# Altium project ESIMA_EIS.PrjPcb (part 1 of 2)
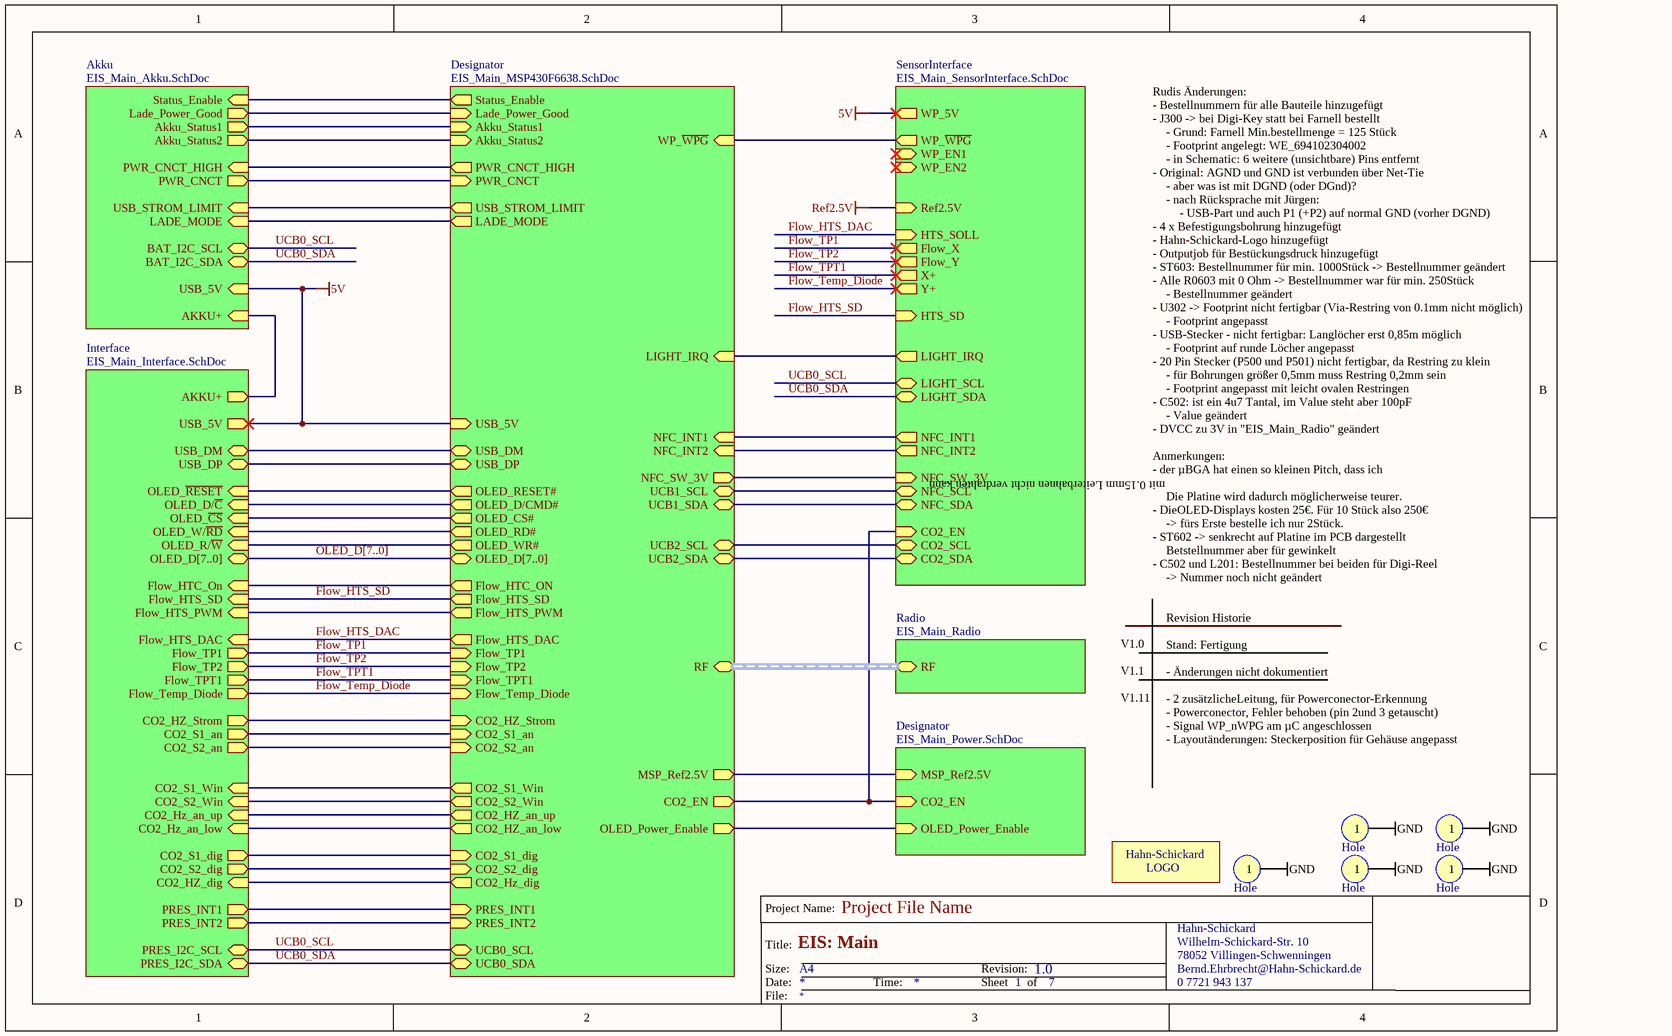
[diagram p0: EIS_Main.SchDoc]
7 sheets, 173 parts. Net scope: hierarchical (ports join the sheet entries above them; power ports are global).
Board file: ESIMA_EIS.PcbDoc
Sheets:
  EIS_Main.SchDoc
    Akku = EIS_Main_Akku.SchDoc
    Radio = EIS_Main_Radio.SchDoc
    Interface = EIS_Main_Interface.SchDoc
    Designator = EIS_Main_MSP430F6638.SchDoc
    SensorInterface = EIS_Main_SensorInterface.SchDoc
    Designator = EIS_Main_Power.SchDoc

## Sheet EIS_Main.SchDoc: EIS: Main
size A4; Organization: Hahn-Schickard; Address1: Wilhelm-Schickard-Str. 10; Address2: 78052 Villingen-Schwenningen; Address3: Bernd.Ehrbrecht@Hahn-Schickard.de; DocumentNumber: 1; Revision: 1.0; SheetNumber: 1; SheetTotal: 7; PhoneNumber: 0 7721 943 137; E-Mail: Xxxx.Xxxx@Hahn-Schickard.de; ProjectName: Project File Name

### Parts
LOGO1  Hahn-Schickard-Logo  [Hahn-Schickard-LOGO_klein]  (value not drawn)
X1  Hole  [Hole_2mm]
X2  Hole  [Hole_2mm]
X3  Hole  [Hole_2mm]
X4  Hole  [Hole_2mm]
X5  Hole  [Hole_2mm]

### Sub-sheets
Akku = EIS_Main_Akku.SchDoc: LADE_MODE (in), USB_STROM_LIMIT (in), Akku_Status1 (out), Akku_Status2 (out), BAT_I2C_SDA (bidir), BAT_I2C_SCL (bidir), USB_5V (in), Lade_Power_Good (out), Status_Enable (in), AKKU+ (in), PWR_CNCT (out), PWR_CNCT_HIGH (in)
Designator = EIS_Main_MSP430F6638.SchDoc: Flow_HTC_ON (out), OLED_D/CMD# (out), Flow_HTS_DAC (out), PRES_INT1 (in), LADE_MODE (out), USB_STROM_LIMIT (out), Akku_Status1 (in), Akku_Status2 (in), OLED_Power_Enable (out), Flow_TPT1 (in), Flow_TP1 (in), Flow_TP2 (in), Flow_Temp_Diode (in), UCB0_SCL (bidir), UCB0_SDA (bidir), CO2_S2_dig (in), CO2_S1_dig (in), CO2_HZ_Strom (in), CO2_Hz_dig (out), CO2_S1_an (in), CO2_S2_an (in), MSP_Ref2.5V (out), OLED_RESET# (out), OLED_CS# (out), USB_5V (in), CO2_HZ_an_low (out), CO2_S2_Win (out), CO2_S1_Win (out), CO2_HZ_an_up (out), PRES_INT2 (in), OLED_WR# (out), OLED_RD# (out), USB_DM (bidir), USB_DP (bidir), OLED_D[7..0] (bidir), RF (harness RF), Flow_HTS_SD (out), Flow_HTS_PWM (out), UCB1_SCL (bidir), UCB1_SDA (bidir), UCB2_SDA (bidir), UCB2_SCL (bidir), Lade_Power_Good (in), Status_Enable (out), CO2_EN (out), NFC_SW_3V (out), NFC_INT1 (in), NFC_INT2 (in), LIGHT_IRQ (in), WP_~{WPG} (in), PWR_CNCT (in), PWR_CNCT_HIGH (out)
Designator = EIS_Main_Power.SchDoc: CO2_EN (in), OLED_Power_Enable (in), MSP_Ref2.5V (in)
Interface = EIS_Main_Interface.SchDoc: USB_5V (out), USB_DM (bidir), USB_DP (bidir), OLED_D[7..0] (bidir), OLED_~{CS} (in), OLED_~{RESET} (in), OLED_D/~{C} (in), OLED_R/~{W} (in), OLED_W/~{RD} (in), Flow_TP2 (out), Flow_Temp_Diode (out), CO2_S2_an (out), CO2_S2_Win (in), CO2_Hz_an_low (in), Flow_HTS_SD (in), CO2_HZ_dig (in), CO2_S2_dig (out), PRES_INT2 (out), PRES_I2C_SDA (bidir), AKKU+ (out), Flow_TP1 (out), Flow_TPT1 (out), CO2_S1_an (out), CO2_HZ_Strom (out), Flow_HTS_DAC (in), CO2_S1_Win (in), CO2_Hz_an_up (in), Flow_HTC_On (in), Flow_HTS_PWM (in), CO2_S1_dig (out), PRES_INT1 (out), PRES_I2C_SCL (bidir)
Radio = EIS_Main_Radio: RF (harness RF)
SensorInterface = EIS_Main_SensorInterface.SchDoc: WP_5V (out), WP_~{WPG} (out), WP_EN1 (in), WP_EN2 (in), NFC_SW_3V (in), NFC_SDA (bidir), NFC_SCL (bidir), NFC_INT1 (out), NFC_INT2 (out), HTS_SD (in), HTS_SOLL (in), Flow_X (out), Flow_Y (out), X+ (out), Y+ (out), Ref2.5V (in), LIGHT_IRQ (out), LIGHT_SDA (bidir), LIGHT_SCL (bidir), CO2_SCL (bidir), CO2_SDA (bidir), CO2_EN (in)

### Nets
5V: sheet Akku/USB_5V, sheet Interface/USB_5V, sheet Designator/USB_5V, sheet SensorInterface/WP_5V  [project net USB_5V]
AKKU+: sheet Akku/AKKU+, sheet Interface/AKKU+
GND: X1.1 X2.1 X3.1 X4.1 X5.1
CO2_EN: sheet Designator/CO2_EN, sheet SensorInterface/CO2_EN, sheet Designator/CO2_EN
CO2_SCL: sheet Designator/UCB2_SCL, sheet SensorInterface/CO2_SCL
CO2_SDA: sheet Designator/UCB2_SDA, sheet SensorInterface/CO2_SDA
Flow_HTS_DAC: sheet Interface/Flow_HTS_DAC, sheet Designator/Flow_HTS_DAC, sheet SensorInterface/HTS_SOLL
Flow_HTS_SD: sheet Interface/Flow_HTS_SD, sheet Designator/Flow_HTS_SD, sheet SensorInterface/HTS_SD
Flow_Temp_Diode: sheet Interface/Flow_Temp_Diode, sheet Designator/Flow_Temp_Diode, sheet SensorInterface/Y+
Flow_TP1: sheet Interface/Flow_TP1, sheet Designator/Flow_TP1, sheet SensorInterface/Flow_X
Flow_TP2: sheet Interface/Flow_TP2, sheet Designator/Flow_TP2, sheet SensorInterface/Flow_Y
Flow_TPT1: sheet Interface/Flow_TPT1, sheet Designator/Flow_TPT1, sheet SensorInterface/X+
LIGHT_IRQ: sheet Designator/LIGHT_IRQ, sheet SensorInterface/LIGHT_IRQ
UCB0_SCL: sheet Akku/BAT_I2C_SCL, sheet Interface/PRES_I2C_SCL, sheet Designator/UCB0_SCL, sheet SensorInterface/LIGHT_SCL  [project net LIGHT_SCL]
UCB0_SDA: sheet Akku/BAT_I2C_SDA, sheet Interface/PRES_I2C_SDA, sheet Designator/UCB0_SDA, sheet SensorInterface/LIGHT_SDA  [project net LIGHT_SDA]
UCB1_SCL: sheet Designator/UCB1_SCL, sheet SensorInterface/NFC_SCL
UCB1_SDA: sheet Designator/UCB1_SDA, sheet SensorInterface/NFC_SDA
USB_DM: sheet Interface/USB_DM, sheet Designator/USB_DM
USB_DP: sheet Interface/USB_DP, sheet Designator/USB_DP
NetC103_1: sheet Designator/MSP_Ref2.5V, sheet Designator/MSP_Ref2.5V
NetJ300_2: sheet Akku/PWR_CNCT, sheet Designator/PWR_CNCT
NetP500_5: sheet Interface/CO2_S1_an, sheet Designator/CO2_S1_an
NetP500_6: sheet Interface/CO2_S2_an, sheet Designator/CO2_S2_an
NetP500_7: sheet Interface/CO2_HZ_Strom, sheet Designator/CO2_HZ_Strom
NetP500_13: sheet Interface/CO2_S1_Win, sheet Designator/CO2_S1_Win
NetP500_14: sheet Interface/CO2_S2_Win, sheet Designator/CO2_S2_Win
NetP500_15: sheet Interface/CO2_Hz_an_up, sheet Designator/CO2_HZ_an_up
NetP500_16: sheet Interface/CO2_Hz_an_low, sheet Designator/CO2_HZ_an_low
NetP501_1: sheet Interface/Flow_HTC_On, sheet Designator/Flow_HTC_ON
NetP501_3: sheet Interface/Flow_HTS_PWM, sheet Designator/Flow_HTS_PWM
NetP501_4: sheet Interface/CO2_HZ_dig, sheet Designator/CO2_Hz_dig
NetP501_5: sheet Interface/CO2_S1_dig, sheet Designator/CO2_S1_dig
NetP501_6: sheet Interface/CO2_S2_dig, sheet Designator/CO2_S2_dig
NetP501_7: sheet Interface/PRES_INT1, sheet Designator/PRES_INT1
NetP501_8: sheet Interface/PRES_INT2, sheet Designator/PRES_INT2
NetR107_1: sheet Designator/WP_~{WPG}, sheet SensorInterface/WP_~{WPG}
NetR305_2: sheet Akku/LADE_MODE, sheet Designator/LADE_MODE
NetR306_2: sheet Akku/USB_STROM_LIMIT, sheet Designator/USB_STROM_LIMIT
NetR310_1: sheet Akku/Status_Enable, sheet Designator/Status_Enable
NetR310_2: sheet Akku/Lade_Power_Good, sheet Designator/Lade_Power_Good
NetR311_2: sheet Akku/Akku_Status2, sheet Designator/Akku_Status2
NetR312_2: sheet Akku/Akku_Status1, sheet Designator/Akku_Status1
NetR316_1: sheet Akku/PWR_CNCT_HIGH, sheet Designator/PWR_CNCT_HIGH
NetST600_2: sheet Designator/NFC_INT2, sheet SensorInterface/NFC_INT2
NetST600_3: sheet Designator/NFC_INT1, sheet SensorInterface/NFC_INT1
NetST600_6: sheet Designator/NFC_SW_3V, sheet SensorInterface/NFC_SW_3V
NetU100_5: sheet Interface/OLED_~{RESET}, sheet Designator/OLED_RESET#
NetU100_6: sheet Interface/OLED_D/~{C}, sheet Designator/OLED_D/CMD#
NetU100_7: sheet Interface/OLED_R/~{W}, sheet Designator/OLED_WR#
NetU100_8: sheet Interface/OLED_W/~{RD}, sheet Designator/OLED_RD#
NetU100_52: sheet Designator/OLED_Power_Enable, sheet Designator/OLED_Power_Enable
NetU100_53: sheet Interface/OLED_~{CS}, sheet Designator/OLED_CS#

### Buses and harness runs
bus OLED_D[7..0] = sheet Designator/OLED_D[7..0] = sheet Interface/OLED_D[7..0]
harness sheet Designator/RF = sheet Radio/RF

### Notes on the sheet
- Rudis Änderungen:
- - Bestellnummern für alle Bauteile hinzugefügt
- - J300 -> bei Digi-Key statt bei Farnell bestellt
- - Original: AGND und GND ist verbunden über Net-Tie
- - Grund: Farnell Min.bestellmenge = 125 Stück
- - Footprint angelegt: WE_694102304002
- - in Schematic: 6 weitere (unsichtbare) Pins entfernt
- - 4 x Befestigungsbohrung hinzugefügt
- - Hahn-Schickard-Logo hinzugefügt
- - aber was ist mit DGND (oder DGnd)?
- - nach Rücksprache mit Jürgen:
- - USB-Part und auch P1 (+P2) auf normal GND (vorher DGND)
- - Outputjob für Bestückungsdruck hinzugefügt
- - ST603: Bestellnummer für min. 1000Stück -> Bestellnummer geändert
- - Alle R0603 mit 0 Ohm -> Bestellnummer war für min. 250Stück
- - U302 -> Footprint nicht fertigbar (Via-Restring von 0.1mm nicht möglich)
- - Bestellnummer geändert
- - USB-Stecker - nicht fertigbar: Langlöcher erst 0,85m möglich
- - 20 Pin Stecker (P500 und P501) nicht fertigbar, da Restring zu klein
- - Footprint angepasst
- - Footprint auf runde Löcher angepasst
- - für Bohrungen größer 0,5mm muss Restring 0,2mm sein
- - C502: ist ein 4u7 Tantal, im Value steht aber 100pF
- - DVCC zu 3V in "EIS_Main_Radio" geändert
- - Footprint angepasst mit leicht ovalen Restringen
- - Value geändert
- - der µBGA hat einen so kleinen Pitch, dass ich
- Anmerkungen:
- - DieOLED-Displays kosten 25€. Für 10 Stück also 250€
- mit 0.15mm Leiterbahnen nicht verdrahten kann
- Die Platine wird dadurch möglicherweise teurer.
- - ST602 -> senkrecht auf Platine im PCB dargestellt
- - C502 und L201: Bestellnummer bei beiden für Digi-Reel
- -> fürs Erste bestelle ich nur 2Stück.
- Betstellnummer aber für gewinkelt
- -> Nummer noch nicht geändert
- V1.0
- Revision Historie
- Stand: Fertigung
- V1.1
- V1.11
- - Änderungen nicht dokumentiert
- - 2 zusätzlicheLeitung, für Powerconector-Erkennung
- - Powerconector, Fehler behoben (pin 2und 3 getauscht)
- - Signal WP_nWPG am µC angeschlossen
- - Layoutänderungen: Steckerposition für Gehäuse angepasst
- Project Name:
- Size:
- Date:
- Title:
- A4
- Time:
- Revision:
- Sheet
- of
- File:
- (in symbol Hahn-Schickard-Logo) Hahn-Schickard; LOGO

### Library data of the parts
LOGO1 = Hahn-Schickard-Logo: Hahn-Schickard Logo als Footprint
X1-X5 = Hole: Durchkontaktierung d=4mm

## Sheet EIS_Main_Akku.SchDoc: EIS: Akkulader und Überwachung
size A4; FaxNumber: +49 7721 943 210; Organization: Hahn-Schickard; Address1: Wilhelm-Schickard-Str. 10; Address2: 78052 Villingen-Schwenningen; Address3: Bernd.Ehrbrecht@Hahn-Schickard.de; DocumentNumber: 1; Revision: 1.0; SheetNumber: 4; SheetTotal: 7; PhoneNumber: 0 7721 943 137; E-Mail: Xxxx.Xxxx@Hahn-Schickard.de; PageSetup: Record=PageOptions|CenterHorizontal=True|CenterVertical=True|PrintScale=0.97|XCorrection=1.00|YCorrection=1.00|PrintKind=0|BorderSize=5000000|LeftOffset=0|BottomOffset=0|Orientation=2|PaperLength=1000|PaperWidth=1000|Scale=100|PaperSource=7|PrintQuality=-3|MediaType=1|DitherType=10|PrintScaleMode=1|PaperKind=A4|PaperIndex=9; ProjectName: Project File Name
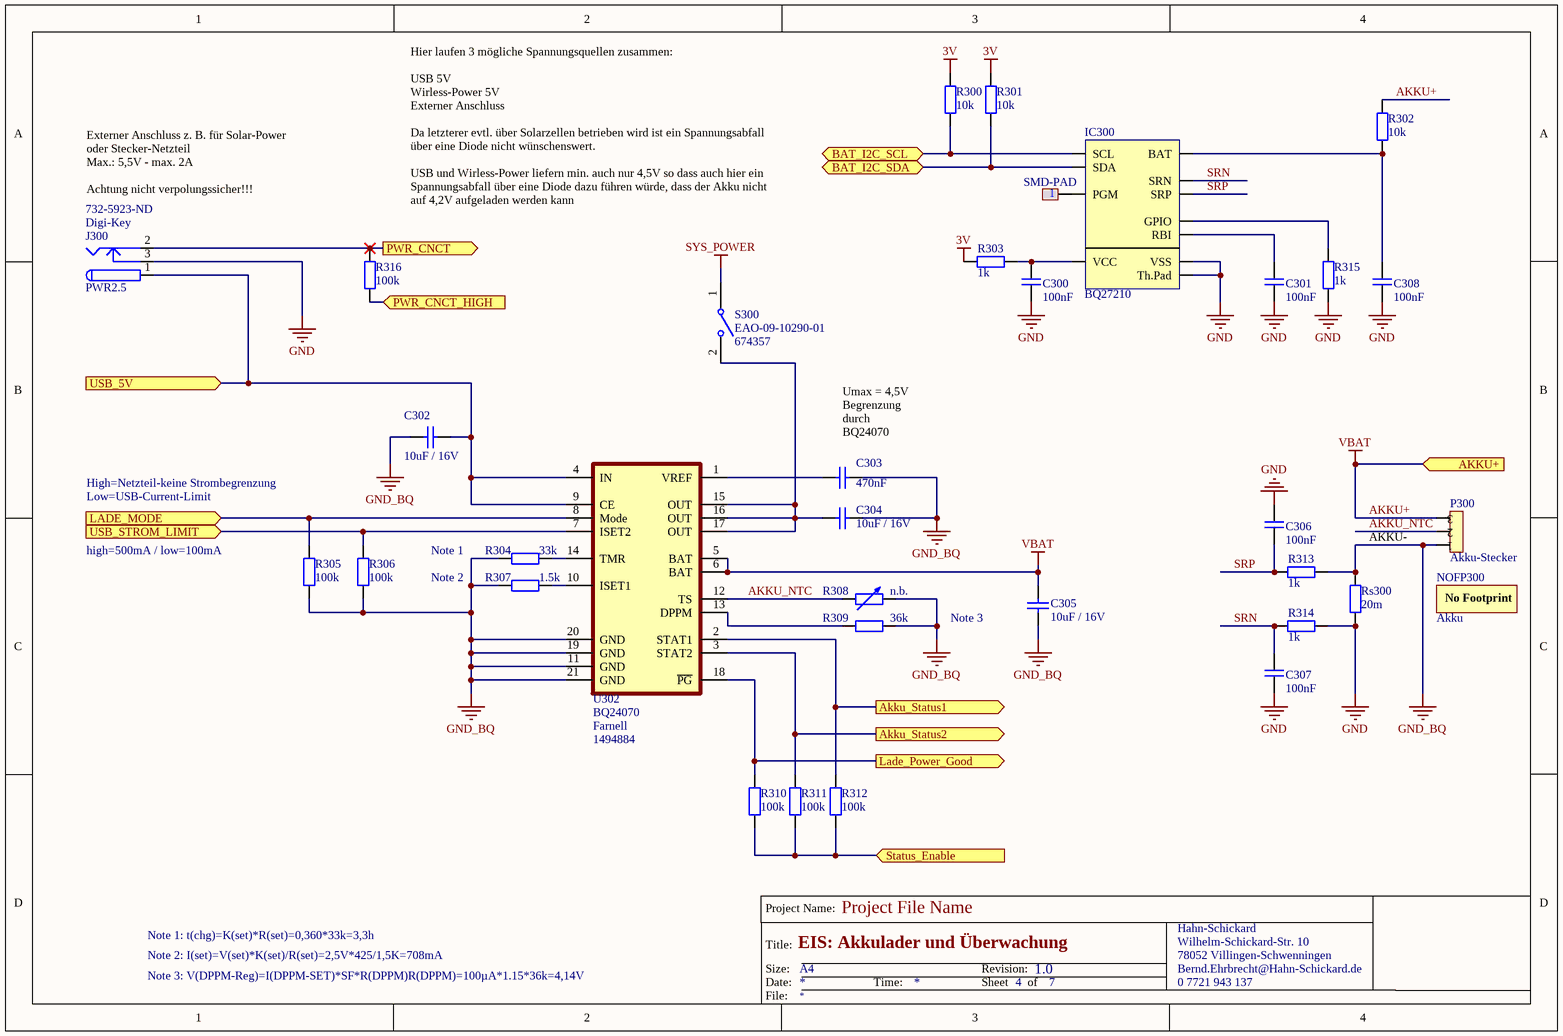
[diagram p1: EIS_Main_Akku.SchDoc]

### Parts
C300  100nF  [CAPC1608N]
C301  100nF  [CAPC1608N]
C302  10uF / 16V  [CAPC2012N]
C303  470nF  [CAPC1608N]
C304  10uF / 16V  [CAPC2012N]
C305  10uF / 16V  [CAPC2012N]
C306  100nF  [CAPC1608N]
C307  100nF  [CAPC1608N]
C308  100nF  [CAPC1608N]
IC300  BQ27210  [TI-DRK-PVSON]
J300  PWR2.5  Supplier 1: Digi-Key  Supplier Part Number 1: 732-5923-ND  [WE_694102304002]
NOFP300  value Akku  [No_Footprint]  (hidden comment: No-Footprint)
P300  Akku-Stecker  [S3B-XH-A]
R300  10k  [RESC1608N]
R301  10k  [RESC1608N]
R302  10k  [RESC1608N]
R303  1k  [RESC1608N]
R304  33k  [RESC1608N]
R305  100k  [RESC1608N]
R306  100k  [RESC1608N]
R307  1.5k  [RESC1608N]
R308  n.b.  [RESC1608N]
R309  36k  [RESC1608N]
R310  100k  [RESC1608N]
R311  100k  [RESC1608N]
R312  100k  [RESC1608N]
R313  1k  [RESC1608N]
R314  1k  [RESC1608N]
R315  1k  [RESC1608N]
R316  100k  [RESC1608N]
Rs300  20m  [RESC3216N]
S300  EAO-09-10290-01  Supplier Part Number 1: 674357  [EAO09-10290-01]
S301  SMD-PAD  [SMD_PAD]
U302  BQ24070  Supplier 1: Farnell  Supplier Part Number 1: 1494884  [R-PVQFN50P450X350X100-20N]

### Ports
AKKU+ (in), Akku_Status1 (out), Akku_Status2 (out), BAT_I2C_SCL (bidir), BAT_I2C_SDA (bidir), LADE_MODE (in), Lade_Power_Good (out), PWR_CNCT (out), PWR_CNCT_HIGH (in), Status_Enable (in), USB_5V (in), USB_STROM_LIMIT (in)

### Nets
3V: R300.2 R301.2 R303.2
AKKU+: C305.2 P300.3 R302.2 U302.5(BAT) U302.6(BAT) ; port AKKU+  [also labelled VBAT]
GND: C300.1 C301.1 C306.1 C307.1 C308.1 IC300.3(VSS) IC300.11(Th.Pad) J300.3 R314.1 R315.2 Rs300.1
GND_BQ: C302.1 C303.2 C304.2 C305.1 P300.1 R304.1 R305.1 R306.1 R307.1 R308.2 R309.2 R313.1 Rs300.2 U302.11(GND) U302.19(GND) U302.20(GND) U302.21(GND)
SYS_POWER: S300.1(COMMON)
USB_5V: C302.2 J300.1 U302.4(IN) U302.9(CE) ; port USB_5V
AKKU_NTC: P300.2 R308.1 U302.12(TS)
LIGHT_SCL: IC300.4(SCL) R300.1 ; port BAT_I2C_SCL
LIGHT_SDA: IC300.5(SDA) R301.1 ; port BAT_I2C_SDA
SRN: C307.2 IC300.7(SRN) R314.2
SRP: C306.2 IC300.8(SRP) R313.2
NetC300_2: C300.2 IC300.2(VCC) R303.1
NetC301_2: C301.2 IC300.1(RBI)
NetC303_1: C303.1 U302.1(VREF)
NetC304_1: C304.1 S300.2(NO) U302.15(OUT) U302.16(OUT) U302.17(OUT)
NetC308_2: C308.2 IC300.6(BAT) R302.1
NetIC300_9: IC300.9(GPIO) R315.1
NetIC300_10: IC300.10(PGM) S301.1
NetJ300_2: J300.2 R316.2 ; port PWR_CNCT
NetR304_2: R304.2 U302.14(TMR)
NetR305_2: R305.2 U302.8(Mode) ; port LADE_MODE
NetR306_2: R306.2 U302.7(ISET2) ; port USB_STROM_LIMIT
NetR307_2: R307.2 U302.10(ISET1)
NetR309_1: R309.1 U302.13(DPPM)
NetR310_1: R310.1 R311.1 R312.1 ; port Status_Enable
NetR310_2: R310.2 U302.18(~{PG}) ; port Lade_Power_Good
NetR311_2: R311.2 U302.3(STAT2) ; port Akku_Status2
NetR312_2: R312.2 U302.2(STAT1) ; port Akku_Status1
NetR316_1: R316.1 ; port PWR_CNCT_HIGH

### Notes on the sheet
- Externer Anschluss z. B. für Solar-Power
  oder Stecker-Netzteil
  Max.: 5,5V - max. 2A
  Achtung nicht verpolungssicher!!!
- Hier laufen 3 mögliche Spannungsquellen zusammen:
  USB 5V
  Wirless-Power 5V
  Externer Anschluss
  Da letzterer evtl. über Solarzellen betrieben wird ist ein Spannungsabfall über eine Diode nicht wünschenswert.
  USB und Wirless-Power liefern min. auch nur 4,5V so dass auch hier ein Spannungsabfall über eine Diode dazu führen würde, dass der Akku nicht auf 4,2V aufgeladen werden kann
- (near C303) Umax = 4,5V
  Begrenzung
  durch
  BQ24070
- Low=USB-Current-Limit
- High=Netzteil-keine Strombegrenzung
- high=500mA / low=100mA
- Note 2
- Note 1
- AKKU-
- Note 3
- Note 1: t(chg)=K(set)*R(set)=0,360*33k=3,3h
- Note 2: I(set)=V(set)*K(set)/R(set)=2,5V*425/1,5K=708mA
- Note 3: V(DPPM-Reg)=I(DPPM-SET)*SF*R(DPPM)R(DPPM)=100µA*1.15*36k=4,14V
- Project Name:
- Size:
- Date:
- Title:
- A4
- Time:
- Revision:
- Sheet
- of
- File:
- (in symbol No-Footprint) No Footprint

### Library data of the parts
C300 C301 C306-C308 = Kondensator SMD Keramik: 07_Lieferant: Digi-Key; 08_Lieferanten_Nummer: 399-1096-1-ND
C302 C304 C305 = C0805: Ceramic Chip Capacitor - Standard; Note: Footprint corresponds to dimensions for bulk cassette packaging. This case size has tightened tolerances.; 07_Lieferant: Digi-Key; 08_Lieferanten_Nummer: 490-6473-1-ND; Published: 17-Jul-2002; LatestRevisionDate: 19-Mar-2004; LatestRevisionNote: Silkscreen size reduced.; DatasheetDocument: Mar-2001; PackageDocument: Mar-2001; PackageReference: 0805; Publisher: Altium Limited; Code_JEITA: 0805; Code_IPC: 2012[0805]; ComponentLink1Description: Manufacturer Link; ComponentLink1URL: http://www.kemet.com/; ComponentLink2Description: Datasheet; ComponentLink2URL: http://www.kemet.com/kemet/web/homepage/kechome.nsf/vapubfilesname/F3102TA.pdf/$file/F3102TA.pdf; Value: 10uF / 16V
C303 = C0805: Ceramic Chip Capacitor - Standard; Note: Footprint corresponds to dimensions for bulk cassette packaging. This case size has tightened tolerances.; 07_Lieferant: Digi-Key; 08_Lieferanten_Nummer: 445-5152-1-ND; Published: 17-Jul-2002; LatestRevisionDate: 19-Mar-2004; LatestRevisionNote: Silkscreen size reduced.; DatasheetDocument: Mar-2001; PackageDocument: Mar-2001; PackageReference: 0805; Publisher: Altium Limited; Code_JEITA: 0805; Code_IPC: 2012[0805]; ComponentLink1Description: Manufacturer Link; ComponentLink1URL: http://www.kemet.com/; ComponentLink2Description: Datasheet; ComponentLink2URL: http://www.kemet.com/kemet/web/homepage/kechome.nsf/vapubfilesname/F3102TA.pdf/$file/F3102TA.pdf; Value: 470nF
IC300 = BQ27210: i-Ion AND Li-Pol BATTERY GAS GAUGE IC FOR PORTABLE APPLICATIONS; 08_Lieferanten_Nummer: 296-21511-1-ND; 07_Lieferant: Digi-Key; 05_Datasheet_Link_Lokal: Path and File; 10_Erstell_Datum: DD.MM.YYYY; 09_Ersteller: HSG Name; 02_Herstellerbezeichnung: ka; 03_Hersteller_Link: Link; 04_Datasheet_Link: Datasheet; 06 Footprint_Link_Lokal: Path and File
J300 = PWR2.5: Low Voltage Power Supply Connector; Published: 17-Dec-2003; DatasheetDocument: 09-May-2002; Publisher: Altium Limited; ComponentLink1Description: Manufacturer Link; ComponentLink1URL: http://domino.kycon.com/internet/Products.html; 07_Lieferant: Digi-Key; 08_Lieferanten_Nummer: 732-5923-ND
NOFP300 = No-Footprint: Dummy-Bauteil, um Zusatzbestellungen in die BOM einzutragen; 07_Lieferant: Farnell; 08_Lieferanten_Nummer: 2401853
P300 = Header 3X1: Header, 3-Pin; 08_Lieferanten_Nummer: 1516290; 07_Lieferant: Farnell; LatestRevisionDate: 17-Jul-2002; LatestRevisionNote: Re-released for DXP Platform.; Publisher: Altium Limited
R300-R302 = Res2: Resistor; 07_Lieferant: Digi-Key; 08_Lieferanten_Nummer: 311-10KGRCT-ND; Published: 8-Jun-2000; LatestRevisionDate: 17-Jul-2002; LatestRevisionNote: Re-released for DXP Platform.; PackageReference: AXIAL-0.4; Publisher: Altium Limited; Value: 10k
R303 R313-R315 = Res2: Resistor; 07_Lieferant: Farnell; 08_Lieferanten_Nummer: 2309108; Published: 8-Jun-2000; LatestRevisionDate: 17-Jul-2002; LatestRevisionNote: Re-released for DXP Platform.; PackageReference: AXIAL-0.4; Publisher: Altium Limited; Value: 1k
R304 = Res2: Resistor; 07_Lieferant: Digi-Key; 08_Lieferanten_Nummer: 311-33KGRCT-ND; Published: 8-Jun-2000; LatestRevisionDate: 17-Jul-2002; LatestRevisionNote: Re-released for DXP Platform.; PackageReference: AXIAL-0.4; Publisher: Altium Limited; Value: 33k
R305 R306 R310-R312 R316 = Res2: Resistor; 07_Lieferant: Digi-Key; 08_Lieferanten_Nummer: 311-100KGRCT-ND; Published: 8-Jun-2000; LatestRevisionDate: 17-Jul-2002; LatestRevisionNote: Re-released for DXP Platform.; PackageReference: AXIAL-0.4; Publisher: Altium Limited; Value: 100k
R307 = Res2: Resistor; 07_Lieferant: Digi-Key; 08_Lieferanten_Nummer: RG16P1.5KBTR-ND; Published: 8-Jun-2000; LatestRevisionDate: 17-Jul-2002; LatestRevisionNote: Re-released for DXP Platform.; PackageReference: AXIAL-0.4; Publisher: Altium Limited; Value: 1.5k
R308 = Res Adj2: Variable Resistor; Set Position: 0.5; Published: 8-Jun-2000; LatestRevisionDate: 17-Jul-2002; LatestRevisionNote: Re-released for DXP Platform.; PackageReference: AXIAL-0.6; Publisher: Altium Limited; Value: n.b.; Supplier 1: Farnell; Supplier Part Number 1: 1672343
R309 = Res2: Resistor; 07_Lieferant: Digi-Key; 08_Lieferanten_Nummer: 311-36KGRCT-ND; Published: 8-Jun-2000; LatestRevisionDate: 17-Jul-2002; LatestRevisionNote: Re-released for DXP Platform.; PackageReference: AXIAL-0.4; Publisher: Altium Limited; Value: 36k
Rs300 = RESC1005N (R0402): Suplier: Seller; Suplier Ordering Number: Ordering Number; 07_Lieferant: Farnell; 08_Lieferanten_Nummer: 1462292; Published: 14.08.2009; Publisher: HSG Jürgen Merz; Value: 20m; ComponentLink1Description: RESC1005N (R0402) 1%
S300 = Schalter universal 1Polig: 01_Hersteller: Manufaktor Link; 05_Datasheet_Link_Lokal: Path and File; 10_Erstell_Datum: DD-MM-YYYY; 09_Ersteller: HSG Name; 02_Herstellerbezeichnung: ka; 07_Lieferant: Farnell; 03_Hersteller_Link: Link; 04_Datasheet_Link: Datasheet; 06 Footprint_Link_Lokal: Path and File; Supplier 1: Farnell; 08_Lieferanten_Nummer: 674357
S301 = SMD_PAD: SMD-PAD für Debugvorgang
U302 = BQ24070: Lithum Ion Ladebaustein, Power Path; 07_Lieferant: Farnell; 08_Lieferanten_Nummer: 1494884

## Sheet EIS_Main_Radio.SchDoc: EIS: Funk-Anbindung
size A4; FaxNumber: +49 7721 943 210; Organization: Hahn-Schickard; Address1: Wilhelm-Schickard-Str. 10; Address2: 78052 Villingen-Schwenningen; Address3: Bernd.Ehrbrecht@Hahn-Schickard.de; DocumentNumber: 1; Revision: 1.0; SheetNumber: 5; SheetTotal: 7; PhoneNumber: 0 7721 943 137; E-Mail: Xxxx.Xxxx@Hahn-Schickard.de; ProjectName: Project File Name
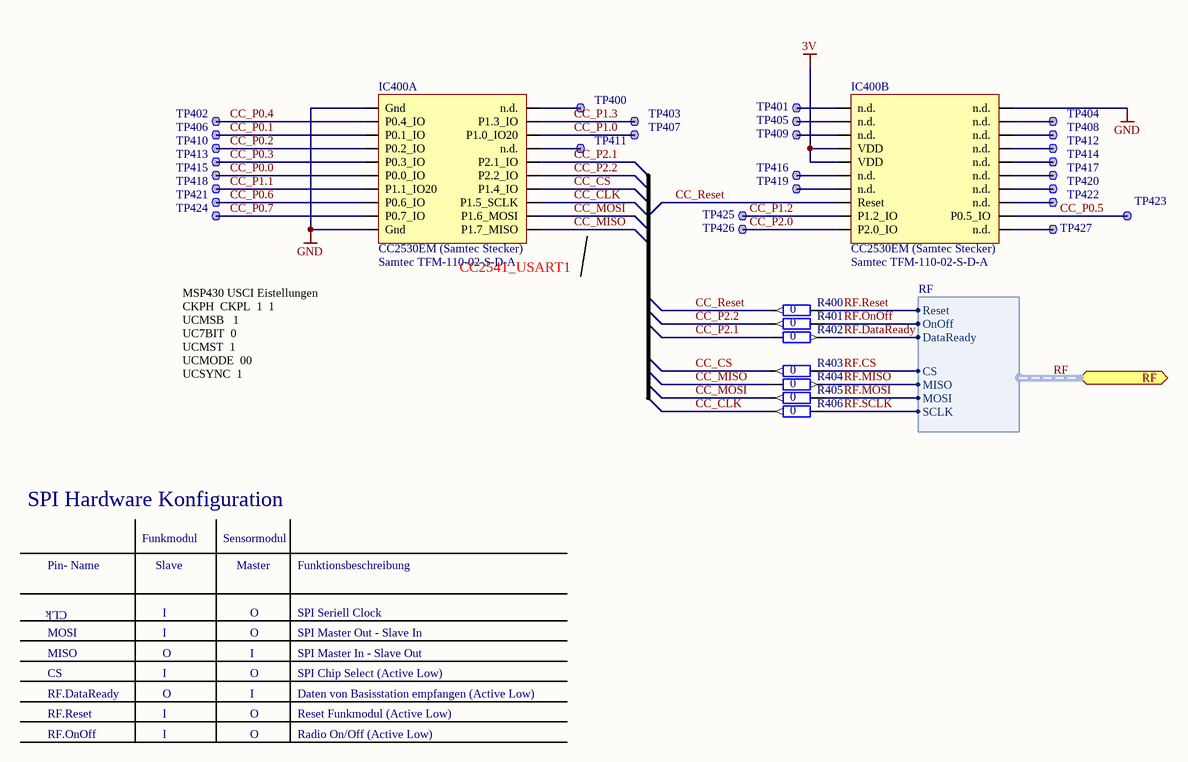
[diagram p2: EIS_Main_Radio.SchDoc]

### Parts
IC400  CC2530EM (Samtec Stecker)  01_Hersteller: Samtec TFM-110-02-S-D-A  [CC2400EM_Board]  (parts A,B of 2)
R400  0  [RESC1608N]
R401  0  [RESC1608N]
R402  0  [RESC1608N]
R403  0  [RESC1608N]
R404  0  [RESC1608N]
R405  0  [RESC1608N]
R406  0  [RESC1608N]
TP400  Testpoint 1mm  [Testpoint 1mm]  (value not drawn)  (no BOM)
TP401  Testpoint 1mm  [Testpoint 1mm]  (value not drawn)  (no BOM)
TP402  Testpoint 1mm  [Testpoint 1mm]  (value not drawn)  (no BOM)
TP403  Testpoint 1mm  [Testpoint 1mm]  (value not drawn)  (no BOM)
TP404  Testpoint 1mm  [Testpoint 1mm]  (value not drawn)  (no BOM)
TP405  Testpoint 1mm  [Testpoint 1mm]  (value not drawn)  (no BOM)
TP406  Testpoint 1mm  [Testpoint 1mm]  (value not drawn)  (no BOM)
TP407  Testpoint 1mm  [Testpoint 1mm]  (value not drawn)  (no BOM)
TP408  Testpoint 1mm  [Testpoint 1mm]  (value not drawn)  (no BOM)
TP409  Testpoint 1mm  [Testpoint 1mm]  (value not drawn)  (no BOM)
TP410  Testpoint 1mm  [Testpoint 1mm]  (value not drawn)  (no BOM)
TP411  Testpoint 1mm  [Testpoint 1mm]  (value not drawn)  (no BOM)
TP412  Testpoint 1mm  [Testpoint 1mm]  (value not drawn)  (no BOM)
TP413  Testpoint 1mm  [Testpoint 1mm]  (value not drawn)  (no BOM)
TP414  Testpoint 1mm  [Testpoint 1mm]  (value not drawn)  (no BOM)
TP415  Testpoint 1mm  [Testpoint 1mm]  (value not drawn)  (no BOM)
TP416  Testpoint 1mm  [Testpoint 1mm]  (value not drawn)  (no BOM)
TP417  Testpoint 1mm  [Testpoint 1mm]  (value not drawn)  (no BOM)
TP418  Testpoint 1mm  [Testpoint 1mm]  (value not drawn)  (no BOM)
TP419  Testpoint 1mm  [Testpoint 1mm]  (value not drawn)  (no BOM)
TP420  Testpoint 1mm  [Testpoint 1mm]  (value not drawn)  (no BOM)
TP421  Testpoint 1mm  [Testpoint 1mm]  (value not drawn)  (no BOM)
TP422  Testpoint 1mm  [Testpoint 1mm]  (value not drawn)  (no BOM)
TP423  Testpoint 1mm  [Testpoint 1mm]  (value not drawn)  (no BOM)
TP424  Testpoint 1mm  [Testpoint 1mm]  (value not drawn)  (no BOM)
TP425  Testpoint 1mm  [Testpoint 1mm]  (value not drawn)  (no BOM)
TP426  Testpoint 1mm  [Testpoint 1mm]  (value not drawn)  (no BOM)
TP427  Testpoint 1mm  [Testpoint 1mm]  (value not drawn)  (no BOM)

### Ports
RF (harness RF)

### Harnesses
RF: SCLK, MOSI, MISO, CS, DataReady, OnOff, Reset

### Nets
3V: IC400.P2_7(VDD) IC400.P2_9(VDD)
GND: IC400.P1_1(Gnd) IC400.P1_19(Gnd) IC400.P2_2(n.d.)
CC_CLK: IC400.P1_16(P1.5_SCLK) R406.1
CC_CS: IC400.P1_14(P1.4_IO) R403.1
CC_MISO: IC400.P1_20(P1.7_MISO) R404.1
CC_MOSI: IC400.P1_18(P1.6_MOSI) R405.1
CC_P0.0: IC400.P1_11(P0.0_IO) TP415.1
CC_P0.1: IC400.P1_5(P0.1_IO) TP406.1
CC_P0.2: IC400.P1_7(P0.2_IO) TP410.1
CC_P0.3: IC400.P1_9(P0.3_IO) TP413.1
CC_P0.4: IC400.P1_3(P0.4_IO) TP402.1
CC_P0.5: IC400.P2_18(P0.5_IO) TP423.1
CC_P0.6: IC400.P1_15(P0.6_IO) TP421.1
CC_P0.7: IC400.P1_17(P0.7_IO) TP424.1
CC_P1.0: IC400.P1_6(P1.0_IO20) TP407.1
CC_P1.1: IC400.P1_13(P1.1_IO20) TP418.1
CC_P1.2: IC400.P2_17(P1.2_IO) TP425.1
CC_P1.3: IC400.P1_4(P1.3_IO) TP403.1
CC_P2.0: IC400.P2_19(P2.0_IO) TP426.1
CC_P2.1: IC400.P1_10(P2.1_IO) R402.1
CC_P2.2: IC400.P1_12(P2.2_IO) R401.1
CC_Reset: IC400.P2_15(Reset) R400.1
RF.CS: R403.2 ; port RF.CS
RF.DataReady: R402.2 ; port RF.DataReady
RF.MISO: R404.2 ; port RF.MISO
RF.MOSI: R405.2 ; port RF.MOSI
RF.OnOff: R401.2 ; port RF.OnOff
RF.Reset: R400.2 ; port RF.Reset
RF.SCLK: R406.2 ; port RF.SCLK
NetIC400_P1_2: IC400.P1_2(n.d.) TP400.1
NetIC400_P1_8: IC400.P1_8(n.d.) TP411.1
NetIC400_P2_1: IC400.P2_1(n.d.) TP401.1
NetIC400_P2_3: IC400.P2_3(n.d.) TP405.1
NetIC400_P2_4: IC400.P2_4(n.d.) TP404.1
NetIC400_P2_5: IC400.P2_5(n.d.) TP409.1
NetIC400_P2_6: IC400.P2_6(n.d.) TP408.1
NetIC400_P2_8: IC400.P2_8(n.d.) TP412.1
NetIC400_P2_10: IC400.P2_10(n.d.) TP414.1
NetIC400_P2_11: IC400.P2_11(n.d.) TP416.1
NetIC400_P2_12: IC400.P2_12(n.d.) TP417.1
NetIC400_P2_13: IC400.P2_13(n.d.) TP419.1
NetIC400_P2_14: IC400.P2_14(n.d.) TP420.1
NetIC400_P2_16: IC400.P2_16(n.d.) TP422.1
NetIC400_P2_20: IC400.P2_20(n.d.) TP427.1

### Buses and harness runs
harness RF = port RF

### Notes on the sheet
- (near IC400) CC2541_USART1
- MSP430 USCI Eistellungen
  CKPH  CKPL 	1  1
  UCMSB 		1
  UC7BIT		0
  UCMST		1
  UCMODE		00
  UCSYNC		1
- SPI Hardware Konfiguration
- Pin- Name
- Funkmodul
- Slave
- Sensormodul
- Master
- Funktionsbeschreibung
- MOSI
- CLk
- I
- O
- SPI Seriell Clock
- SPI Master Out - Slave In
- MISO
- CS
- RF.DataReady
- RF.Reset
- SPI Chip Select (Active Low)
- Reset Funkmodul (Active Low)
- Daten von Basisstation empfangen (Active Low)
- SPI Master In - Slave Out
- RF.OnOff
- Radio On/Off (Active Low)
- Project Name:
- Size:
- Date:
- Title:
- A4
- Time:
- Revision:
- Sheet
- of
- File:

### Library data of the parts
IC400 = CC2530EM: CC2530EM Referenzdesign, Samtec TFM-110-02-S-D-A; 05_Datasheet_Link_Lokal: O:\Altium Designer\Datasheets\Texas Instruments\CC2400EVA; 09_Ersteller: HSG Rachid Nouna; 02_Herstellerbezeichnung: ka; 03_Hersteller_Link: http://www.ti.com; 04_Datasheet_Link: Datasheet; 06 Footprint_Link_Lokal: O:\Altium Designer\Datasheets\Texas Instruments\CC2400EVA; 10_Erstell_Datum: 21.9.2009; 07_Lieferant: Samtec; 08_Lieferanten_Nummer: TFM-110-02-S-D-A
R400-R406 = RESC1608 (R0603): 07_Lieferant: Farnell; 08_Lieferanten_Nummer: 2059527; Supplier 1: Farnell; Supplier Part Number 1: 2008343
TP400-TP427 = Tespoint 1mm

## Sheet EIS_Main_Interface.SchDoc: Optionale Schnittstellen
size A4; Organization: Hahn-Schickard; Address1: Wilhelm-Schickard-Str. 10; Address2: 78052 Villingen-Schwenningen; Address3: Bernd.Ehrbrecht@Hahn-Schickard.de; DocumentNumber: 1; Revision: 1.0; SheetNumber: 6; SheetTotal: 7; PhoneNumber: 0 7721 943 137; E-Mail: Xxxx.Xxxx@Hahn-Schickard.de; ProjectName: Project File Name
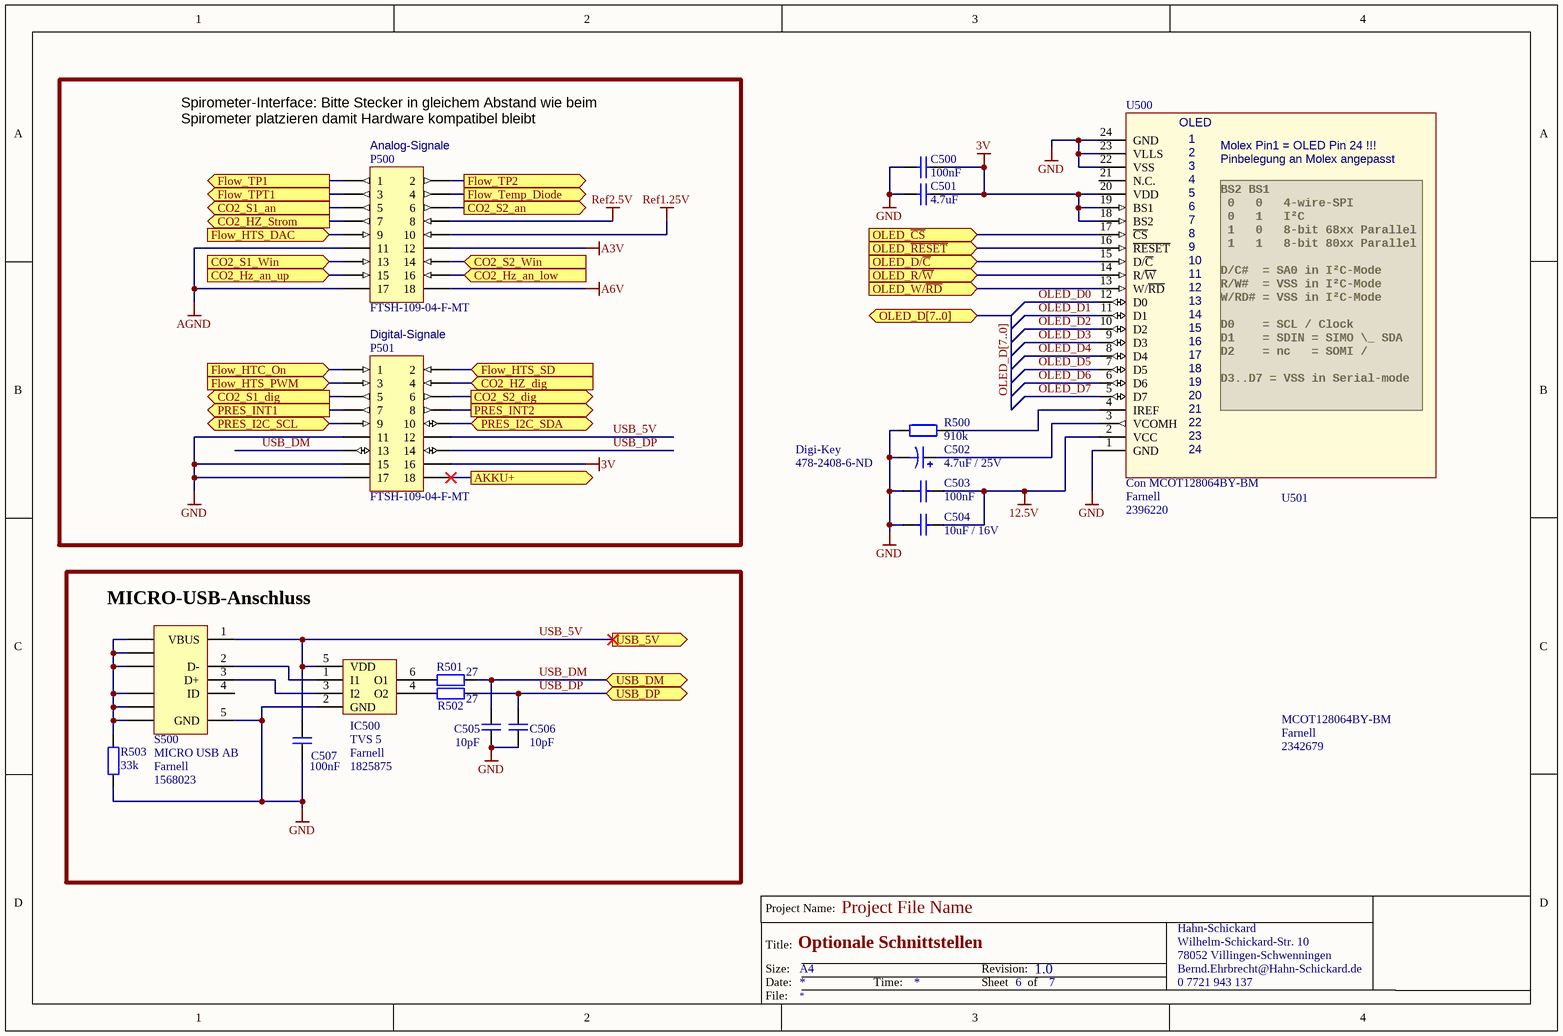
[diagram p3: EIS_Main_Interface.SchDoc]

### Parts
C500  100nF  [CAPC1608N]
C501  4.7uF  [CAPC2012N]
C502  4.7uF / 25V  Supplier 1: Digi-Key  Supplier Part Number 1: 478-2408-6-ND  [C1210]
C503  100nF  [CAPC1608N]
C504  10uF / 16V  [CAPC2012N]
C505  10pF  [CAPC1608N]
C506  10pF  [CAPC1608N]
C507  100nF  [CAPC1608N]
IC500  TVS 5  Supplier 1: Farnell  Supplier Part Number 1: 1825875  [SOT23-6]
P500  FTSH-109-04-F-MT  [FTSH-109-01-X-MT-spezial]
P501  FTSH-109-04-F-MT  [FTSH-109-01-X-MT-spezial]
R500  910k  [RESC1608N]
R501  27  [RESC1608N]
R502  27  [RESC1608N]
R503  33k  [RESC1608N]
S500  MICRO USB AB  Supplier 1: Farnell  Supplier Part Number 1: 1568023  [MICRO USB AB REC]
U500  Con MCOT128064BY-BM  Supplier 1: Farnell  Supplier Part Number 1: 2396220  [Molex-52435-2471]
U501  MCOT128064BY-BM  Supplier 1: Farnell  Supplier Part Number 1: 2342679  (mechanical)

### Ports
AKKU+ (out), CO2_Hz_an_low (in), CO2_Hz_an_up (in), CO2_HZ_dig (in), CO2_HZ_Strom (out), CO2_S1_an (out), CO2_S1_dig (out), CO2_S1_Win (in), CO2_S2_an (out), CO2_S2_dig (out), CO2_S2_Win (in), Flow_HTC_On (in), Flow_HTS_DAC (in), Flow_HTS_PWM (in), Flow_HTS_SD (in), Flow_Temp_Diode (out), Flow_TP1 (out), Flow_TP2 (out), Flow_TPT1 (out), OLED_D/~{C} (in), OLED_D[7..0] (bidir), OLED_R/~{W} (in), OLED_W/~{RD} (in), OLED_~{CS} (in), OLED_~{RESET} (in), PRES_I2C_SCL (bidir), PRES_I2C_SDA (bidir), PRES_INT1 (out), PRES_INT2 (out), USB_5V (out), USB_DM (bidir), USB_DP (bidir)

### Nets
3V: C500.2 C501.2 P501.16 U500.18(BS2) U500.19(BS1) U500.20(VDD)
12.5V: C503.1 C504.1 U500.2(VCC)
A3V: P500.12
A6V: P500.18
AGND: P500.11 P500.17
AKKU+: P501.18 ; port AKKU+
GND: C500.1 C501.1 C502.2 C503.2 C504.2 C505.2 C506.2 C507.2 IC500.2(GND) P501.11 P501.15 P501.17 R500.2 R503.1 S500.5(GND) U500.1(GND) U500.22(VSS) U500.23(VLLS) U500.24(GND)
Ref1.25V: P500.10
Ref2.5V: P500.8
USB_5V: C507.1 IC500.5(VDD) P501.12 S500.1(VBUS) ; port USB_5V
Flow_HTS_DAC: P500.9 ; port Flow_HTS_DAC
Flow_HTS_SD: P501.2 ; port Flow_HTS_SD
Flow_Temp_Diode: P500.4 ; port Flow_Temp_Diode
Flow_TP1: P500.1 ; port Flow_TP1
Flow_TP2: P500.2 ; port Flow_TP2
Flow_TPT1: P500.3 ; port Flow_TPT1
LIGHT_SCL: P501.9 ; port PRES_I2C_SCL
LIGHT_SDA: P501.10 ; port PRES_I2C_SDA
OLED_D0: U500.12(D0)
OLED_D1: U500.11(D1)
OLED_D2: U500.10(D2)
OLED_D3: U500.9(D3)
OLED_D4: U500.8(D4)
OLED_D5: U500.7(D5)
OLED_D6: U500.6(D6)
OLED_D7: U500.5(D7)
USB_DM: C505.1 P501.13 R501.2 ; port USB_DM
USB_DP: C506.1 P501.14 R502.2 ; port USB_DP
NetC502_1: C502.1 U500.3(VCOMH)
NetIC500_1: IC500.1(I1) S500.2(D-)
NetIC500_3: IC500.3(I2) S500.3(D+)
NetIC500_4: IC500.4(O2) R502.1
NetIC500_6: IC500.6(O1) R501.1
NetP500_5: P500.5 ; port CO2_S1_an
NetP500_6: P500.6 ; port CO2_S2_an
NetP500_7: P500.7 ; port CO2_HZ_Strom
NetP500_13: P500.13 ; port CO2_S1_Win
NetP500_14: P500.14 ; port CO2_S2_Win
NetP500_15: P500.15 ; port CO2_Hz_an_up
NetP500_16: P500.16 ; port CO2_Hz_an_low
NetP501_1: P501.1 ; port Flow_HTC_On
NetP501_3: P501.3 ; port Flow_HTS_PWM
NetP501_4: P501.4 ; port CO2_HZ_dig
NetP501_5: P501.5 ; port CO2_S1_dig
NetP501_6: P501.6 ; port CO2_S2_dig
NetP501_7: P501.7 ; port PRES_INT1
NetP501_8: P501.8 ; port PRES_INT2
NetR500_1: R500.1 U500.4(IREF)
NetR503_2: R503.2 S500.GND1(SHLD) S500.GND2(SHLD) S500.GND3(SHLD) S500.GND4(SHLD) S500.GND5(SHLD) S500.GND6(SHLD)
NetU100_5: U500.16(~{RESET}) ; port OLED_~{RESET}
NetU100_6: U500.15(D/~{C}) ; port OLED_D/~{C}
NetU100_7: U500.14(R/~{W}) ; port OLED_R/~{W}
NetU100_8: U500.13(W/~{RD}) ; port OLED_W/~{RD}
NetU100_53: U500.17(~{CS}) ; port OLED_~{CS}

Not connected (* = marked no-connect by the designer): S500 4(ID); U500 21(N.C.)

### Buses and harness runs
bus OLED_D[7..0] = port OLED_D[7..0]

### Notes on the sheet
- (near P500) Spirometer-Interface: Bitte Stecker in gleichem Abstand wie beim Spirometer platzieren damit Hardware kompatibel bleibt
- (near P500) Analog-Signale
- Digital-Signale
- (near S500) MICRO-USB-Anschluss
- Project Name:
- Size:
- Date:
- Title:
- A4
- Time:
- Revision:
- Sheet
- of
- File:
- (in symbol Con MCOT128064BY-BM) OLED; Molex Pin1 = OLED Pin 24 !!!; Pinbelegung an Molex angepasst; BS2 BS1 / 0   0   4-wire-SPI / 0   1   I²C / 1   0   8-bit 68xx Parallel / 1   1   8-bit 80xx Parallel / D/C#  = SA0 in I²C-Mode / R/W#  = VSS in I²C-Mode / W/RD# = VSS in I²C-Mode / D0    = SCL / Clock / D1    = SDIN = SIMO \_ SDA / D2    = nc   = SOMI / / D3..D7 = VSS in Serial-mode

### Library data of the parts
C500 C503 = C0805: Ceramic Chip Capacitor - Standard; Note: Footprint corresponds to dimensions for bulk cassette packaging. This case size has tightened tolerances.; 07_Lieferant: Digi-Key; 08_Lieferanten_Nummer: 399-1096-1-ND; Published: 17-Jul-2002; LatestRevisionDate: 19-Mar-2004; LatestRevisionNote: Silkscreen size reduced.; DatasheetDocument: Mar-2001; PackageDocument: Mar-2001; PackageReference: 0805; Publisher: Altium Limited; Code_JEITA: 0805; Code_IPC: 2012[0805]; ComponentLink1Description: Manufacturer Link; ComponentLink1URL: http://www.kemet.com/; ComponentLink2Description: Datasheet; ComponentLink2URL: http://www.kemet.com/kemet/web/homepage/kechome.nsf/vapubfilesname/F3102TA.pdf/$file/F3102TA.pdf; Value: 100nF
C501 = C0805: Ceramic Chip Capacitor - Standard; Note: Footprint corresponds to dimensions for bulk cassette packaging. This case size has tightened tolerances.; 07_Lieferant: Digi-Key; 08_Lieferanten_Nummer: 490-6475-1-ND; Published: 17-Jul-2002; LatestRevisionDate: 19-Mar-2004; LatestRevisionNote: Silkscreen size reduced.; DatasheetDocument: Mar-2001; PackageDocument: Mar-2001; PackageReference: 0805; Publisher: Altium Limited; Code_JEITA: 0805; Code_IPC: 2012[0805]; ComponentLink1Description: Manufacturer Link; ComponentLink1URL: http://www.kemet.com/; ComponentLink2Description: Datasheet; ComponentLink2URL: http://www.kemet.com/kemet/web/homepage/kechome.nsf/vapubfilesname/F3102TA.pdf/$file/F3102TA.pdf; Value: 4.7uF
C502 = Cap Pol3: Polarized Capacitor (Surface Mount); Value: 4u7; Published: 8-Jun-2000; LatestRevisionDate: 17-Jul-2002; LatestRevisionNote: Re-released for DXP Platform.; PackageReference: C0805; Publisher: Altium Limited; 07_Lieferant: Digi-Key; 08_Lieferanten_Nummer: 478-2408-6-ND
C504 = C0805: as C302 on sheet EIS_Main_Akku; Published: 17-Jul-2002; LatestRevisionDate: 19-Mar-2004; LatestRevisionNote: Silkscreen size reduced.; DatasheetDocument: Mar-2001; PackageDocument: Mar-2001; PackageReference: 0805; Publisher: Altium Limited; Code_JEITA: 0805; Code_IPC: 2012[0805]; ComponentLink1Description: Manufacturer Link; ComponentLink1URL: http://www.kemet.com/; ComponentLink2Description: Datasheet; ComponentLink2URL: http://www.kemet.com/kemet/web/homepage/kechome.nsf/vapubfilesname/F3102TA.pdf/$file/F3102TA.pdf; Value: 10uF / 16V
C505 C506 = Kondensator SMD Keramik: 07_Lieferant: Digi-Key; 08_Lieferanten_Nummer: 399-1049-1-ND
C507 = Kondensator SMD Keramik: as C300 on sheet EIS_Main_Akku
IC500 = WE-TVS 2K 3,3V 23_6L: 07_Lieferant: Farnell; 08_Lieferanten_Nummer: 1825875
P500 = Header 9X2: Header, 9-Pin, Dual row; 07_Lieferant: Samtec; LatestRevisionDate: 17-Jul-2002; LatestRevisionNote: Re-released for DXP Platform.; Publisher: Altium Limited; 08_Lieferanten_Nummer: FTSH-109-04-F-MT
P501 = Header 9X2: 07_Lieferant: Samtec; LatestRevisionDate: 17-Jul-2002; LatestRevisionNote: Re-released for DXP Platform.; Publisher: Altium Limited; 08_Lieferanten_Nummer: FTSH-109-04-F-MT
R500 = Widerstand SMD: 07_Lieferant: Digi-Key; 08_Lieferanten_Nummer: 311-910KHRCT-ND; Value: 910k
R501 R502 = Widerstand SMD: 07_Lieferant: Digi-Key; 08_Lieferanten_Nummer: 311-27GRCT-ND
R503 = Widerstand SMD: 07_Lieferant: Digi-Key; 08_Lieferanten_Nummer: 311-33KGRCT-ND
S500 = MICRO USB AB: Micro USB AB, MOLEX-47589-0001, BOTTOM MOUNT; 07_Lieferant: Farnell; 08_Lieferanten_Nummer: 1568023
U500 = Con MCOT128064BY-BM: Connector für OLED, 128x64Pixel; 35x17mm / blau; 07_Lieferant: Farnell; 08_Lieferanten_Nummer: 2396220
U501 = MCOT128064BY-BM: OLED; blau; 128x64 Pixel;; 07_Lieferant: Farnell; 08_Lieferanten_Nummer: 2342679

## Sheet EIS_Main_MSP430F6638.SchDoc: EIS: CPU
size A4; FaxNumber: +49 7721 943 210; Organization: Hahn-Schickard; Address1: Wilhelm-Schickard-Str. 10; Address2: 78052 Villingen-Schwenningen; Address3: Bernd.Ehrbrecht@Hahn-Schickard.de; DocumentNumber: 1; Revision: 1.0; SheetNumber: 2; SheetTotal: 7; PhoneNumber: 0 7721 943 137; E-Mail: Xxxx.Xxxx@Hahn-Schickard.de; ProjectName: Project File Name
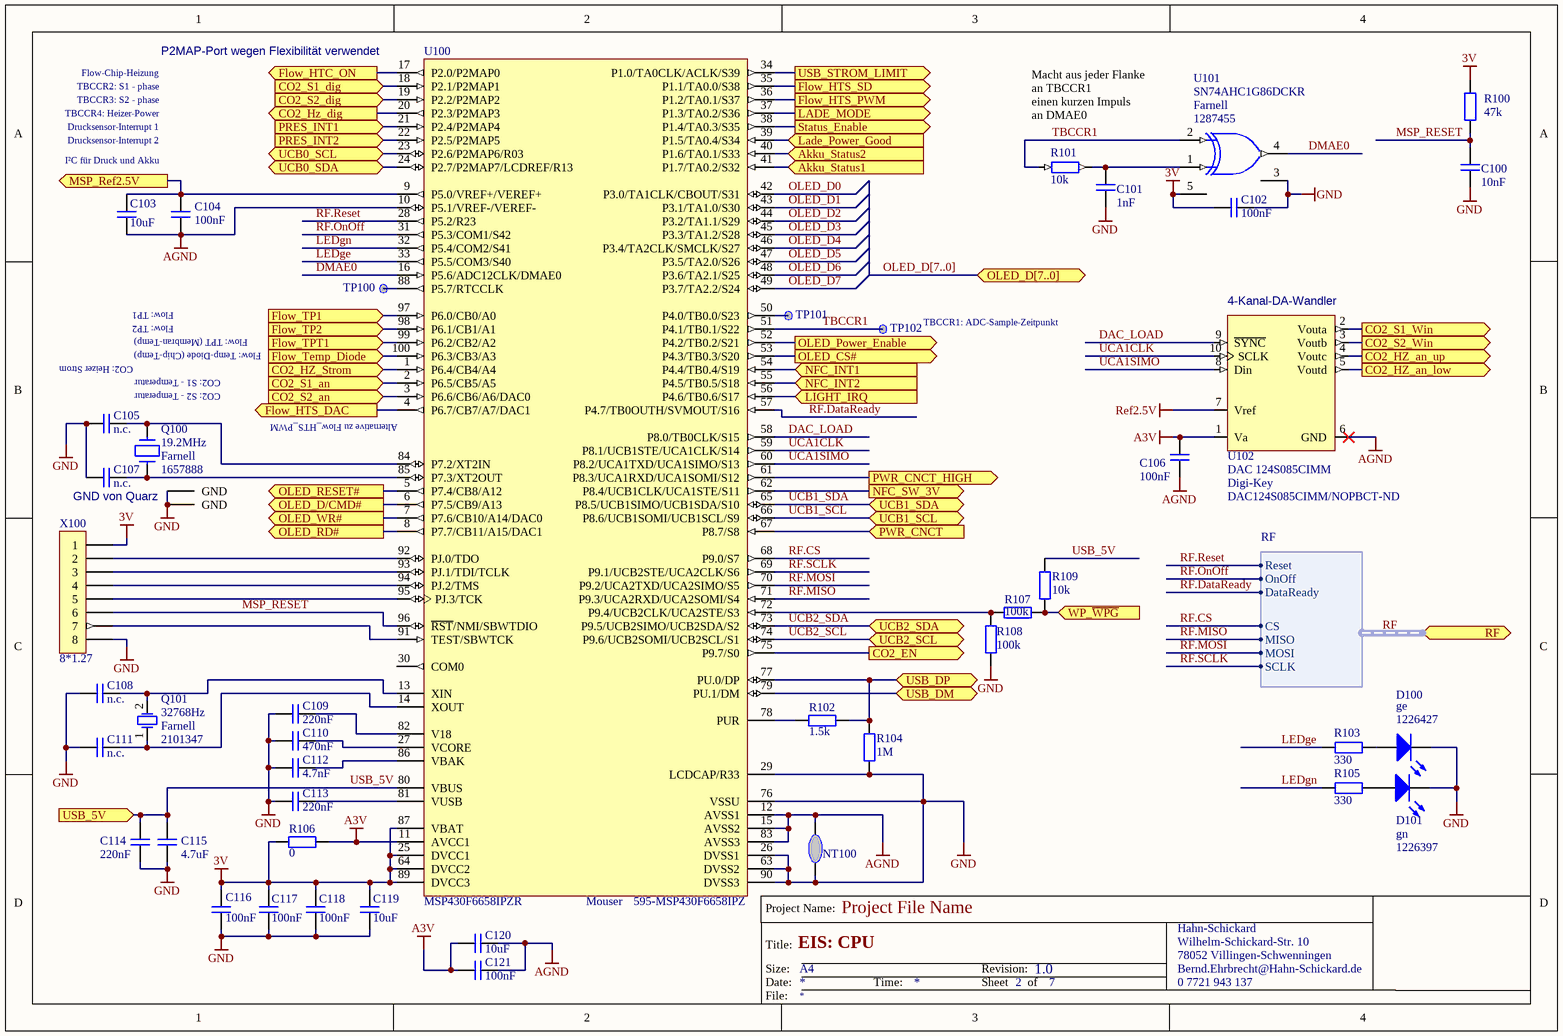
[diagram p4: EIS_Main_MSP430F6638.SchDoc]

### Parts
C100  10nF  [CAPC1608N]
C101  1nF  [CAPC1608N]
C102  100nF  [CAPC1608N]
C103  10uF  [CAPC1608N]
C104  100nF  [CAPC1608N]
C105  n.c.  [CAPC1608N]
C106  100nF  [CAPC1608N]
C107  n.c.  [CAPC1608N]
C108  n.c.  [CAPC1608N]
C109  220nF  [CAPC1608N]
C110  470nF  [CAPC1608N]
C111  n.c.  [CAPC1608N]
C112  4.7nF  [CAPC1608N]
C113  220nF  [CAPC1608N]
C114  220nF  [CAPC1608N]
C115  4.7uF  [CAPC1608N]
C116  100nF  [CAPC1608N]
C117  100nF  [CAPC1608N]
C118  100nF  [CAPC1608N]
C119  10uF  [CAPC1608N]
C120  10uF  [CAPC1608N]
C121  100nF  [CAPC1608N]
D100  ge  Supplier Part Number 1: 1226427  [LED-Gelb]
D101  gn  Supplier Part Number 1: 1226397  [LED-gruen]
NT100  Net Tie without Boom  [NetTie]  (value not drawn)  (net tie, no BOM)
Q100  19.2MHz  Supplier 1: Farnell  Supplier Part Number 1: 1657888  [Quarz 4 Pin 2.5mm*2mm]
Q101  32768Hz  Supplier 1: Farnell  Supplier Part Number 1: 2101347  [ABS07]
R100  47k  [RESC1608N]
R101  10k  [RESC1608N]
R102  1.5k  [RESC1608N]
R103  330  [RESC1608N]
R104  1M  [RESC1608N]
R105  330  [RESC1608N]
R106  0  [RESC1608N]
R107  100k  [RESC1608N]
R108  100k  [RESC1608N]
R109  10k  [RESC1608N]
TP100  Testpoint 1mm  [Testpoint 1mm]  (value not drawn)  (no BOM)
TP101  Testpoint 1mm  [Testpoint 1mm]  (value not drawn)  (no BOM)
TP102  Testpoint 1mm  [Testpoint 1mm]  (value not drawn)  (no BOM)
U100  MSP430F6658IPZR  Supplier 1: Mouser  Supplier Part Number 1: 595-MSP430F6658IPZ  [TI-PZ100_N]
U101  SN74AHC1G86DCKR  Supplier 1: Farnell  Supplier Part Number 1: 1287455  [419A-01_N]
U102  DAC 124S085CIMM  Supplier1: Digi-Key  Supplier Part Number 1: DAC124S085CIMM/NOPBCT-ND  [MSOP-DGS]
X100  8*1.27  [JMP 8x1.27]

### Ports
Akku_Status1 (in), Akku_Status2 (in), CO2_EN (out), CO2_HZ_an_low (out), CO2_HZ_an_up (out), CO2_Hz_dig (out), CO2_HZ_Strom (in), CO2_S1_an (in), CO2_S1_dig (in), CO2_S1_Win (out), CO2_S2_an (in), CO2_S2_dig (in), CO2_S2_Win (out), Flow_HTC_ON (out), Flow_HTS_DAC (out), Flow_HTS_PWM (out), Flow_HTS_SD (out), Flow_Temp_Diode (in), Flow_TP1 (in), Flow_TP2 (in), Flow_TPT1 (in), LADE_MODE (out), Lade_Power_Good (in), LIGHT_IRQ (in), MSP_Ref2.5V (out), NFC_INT1 (in), NFC_INT2 (in), NFC_SW_3V (out), OLED_CS# (out), OLED_D/CMD# (out), OLED_D[7..0] (bidir), OLED_Power_Enable (out), OLED_RD# (out), OLED_RESET# (out), OLED_WR# (out), PRES_INT1 (in), PRES_INT2 (in), PWR_CNCT (in), PWR_CNCT_HIGH (out), RF (harness RF), Status_Enable (out), UCB0_SCL (bidir), UCB0_SDA (bidir), UCB1_SCL (bidir), UCB1_SDA (bidir), UCB2_SCL (bidir), UCB2_SDA (bidir), USB_5V (in), USB_DM (bidir), USB_DP (bidir), USB_STROM_LIMIT (out), WP_~{WPG} (in)

### Harnesses
RF: SCLK, MOSI, MISO, CS, DataReady, OnOff, Reset

### Nets
3V: C102.1 C116.1 C117.1 C118.1 C119.1 R100.2 R106.1 U100.25(DVCC1) U100.64(DVCC2) U100.87(VBAT) U100.89(DVCC3) U101.5(VDD) X100.1
A3V: C106.2 C120.2 C121.1 R106.2 U100.11(AVCC1) U102.1(Va)
AGND: C103.2 C104.2 C106.1 C120.1 C121.2 NT100.2 U100.10(P5.1/VREF-/VEREF-) U100.12(AVSS1) U100.15(AVSS2) U100.83(AVSS3) U102.6(GND)
GND: C100.2 C101.1 C102.2 C105.1 C107.1 C108.2 C109.1 C110.2 C111.1 C112.2 C113.1 C114.2 C115.2 C116.2 C117.2 C118.2 C119.2 D100.2 D101.2 NT100.1 Q100.2(GND) Q100.4(GND) R104.1 R108.1 U100.26(DVSS1) U100.29(LCDCAP/R33) U100.63(DVSS2) U100.76(VSSU) U100.90(DVSS3) U101.3(GND) X100.8
Ref2.5V: U102.7(Vref)
USB_5V: C114.1 C115.1 R109.1 U100.80(VBUS) ; port USB_5V
CO2_EN: U100.75(P9.7/S0) ; port CO2_EN
DAC_LOAD: U100.58(P8.0/TB0CLK/S15) U102.9(~{SYNC})
DMAE0: U100.16(P5.6/ADC12CLK/DMAE0) U101.4(Y)
Flow_HTS_DAC: U100.4(P6.7/CB7/A7/DAC1) ; port Flow_HTS_DAC
Flow_HTS_SD: U100.35(P1.1/TA0.0/S38) ; port Flow_HTS_SD
Flow_Temp_Diode: U100.100(P6.3/CB3/A3) ; port Flow_Temp_Diode
Flow_TP1: U100.97(P6.0/CB0/A0) ; port Flow_TP1
Flow_TP2: U100.98(P6.1/CB1/A1) ; port Flow_TP2
Flow_TPT1: U100.99(P6.2/CB2/A2) ; port Flow_TPT1
LEDge: R103.2 U100.33(P5.5/COM3/S40)
LEDgn: R105.2 U100.32(P5.4/COM2/S41)
LIGHT_IRQ: U100.56(P4.6/TB0.6/S17) ; port LIGHT_IRQ
LIGHT_SCL: U100.23(P2.6/P2MAP6/R03) ; port UCB0_SCL
LIGHT_SDA: U100.24(P2.7/P2MAP7/LCDREF/R13) ; port UCB0_SDA
MSP_RESET: C100.1 R100.1 U100.96(~{RST}/NMI/SBWTDIO) X100.6
OLED_D0: U100.42(P3.0/TA1CLK/CBOUT/S31)
OLED_D1: U100.43(P3.1/TA1.0/S30)
OLED_D2: U100.44(P3.2/TA1.1/S29)
OLED_D3: U100.45(P3.3/TA1.2/S28)
OLED_D4: U100.46(P3.4/TA2CLK/SMCLK/S27)
OLED_D5: U100.47(P3.5/TA2.0/S26)
OLED_D6: U100.48(P3.6/TA2.1/S25)
OLED_D7: U100.49(P3.7/TA2.2/S24)
RF.CS: U100.68(P9.0/S7) ; port RF.CS
RF.DataReady: U100.57(P4.7/TB0OUTH/SVMOUT/S16) ; port RF.DataReady
RF.MISO: U100.71(P9.3/UCA2RXD/UCA2SOMI/S4) ; port RF.MISO
RF.MOSI: U100.70(P9.2/UCA2TXD/UCA2SIMO/S5) ; port RF.MOSI
RF.OnOff: U100.31(P5.3/COM1/S42) ; port RF.OnOff
RF.Reset: U100.28(P5.2/R23) ; port RF.Reset
RF.SCLK: U100.69(P9.1/UCB2STE/UCA2CLK/S6) ; port RF.SCLK
TBCCR1: R101.2 TP102.1 U100.51(P4.1/TB0.1/S22) U101.2(A)
UCA1CLK: U100.59(P8.1/UCB1STE/UCA1CLK/S14) U102.10(SCLK)
UCA1SIMO: U100.60(P8.2/UCA1TXD/UCA1SIMO/S13) U102.8(Din)
UCB1_SCL: U100.66(P8.6/UCB1SOMI/UCB1SCL/S9) ; port UCB1_SCL
UCB1_SDA: U100.65(P8.5/UCB1SIMO/UCB1SDA/S10) ; port UCB1_SDA
UCB2_SCL: U100.74(P9.6/UCB2SOMI/UCB2SCL/S1) ; port UCB2_SCL  [project net CO2_SCL]
UCB2_SDA: U100.73(P9.5/UCB2SIMO/UCB2SDA/S2) ; port UCB2_SDA  [project net CO2_SDA]
USB_DM: U100.79(PU.1/DM) ; port USB_DM
USB_DP: R102.1 R104.2 U100.77(PU.0/DP) ; port USB_DP
NetC101_2: C101.2 R101.1 U101.1(B)
NetC103_1: C103.1 C104.1 U100.9(P5.0/VREF+/VEREF+) ; port MSP_Ref2.5V
NetC105_2: C105.2 Q100.3 U100.84(P7.2/XT2IN)
NetC107_2: C107.2 Q100.1 U100.85(P7.3/XT2OUT)
NetC108_1: C108.1 Q101.2(OSC2) U100.13(XIN)
NetC109_2: C109.2 U100.82(V18)
NetC110_1: C110.1 U100.27(VCORE)
NetC111_2: C111.2 Q101.1(OSC1) U100.14(XOUT)
NetC112_1: C112.1 U100.86(VBAK)
NetC113_2: C113.2 U100.81(VUSB)
NetD100_1: D100.1 R103.1
NetD101_1: D101.1 R105.1
NetJ300_2: U100.67(P8.7/S8) ; port PWR_CNCT
NetP500_5: U100.2(P6.5/CB5/A5) ; port CO2_S1_an
NetP500_6: U100.3(P6.6/CB6/A6/DAC0) ; port CO2_S2_an
NetP500_7: U100.1(P6.4/CB4/A4) ; port CO2_HZ_Strom
NetP500_13: U102.2(Vouta) ; port CO2_S1_Win
NetP500_14: U102.3(Voutb) ; port CO2_S2_Win
NetP500_15: U102.4(Voutc) ; port CO2_HZ_an_up
NetP500_16: U102.5(Voutd) ; port CO2_HZ_an_low
NetP501_1: U100.17(P2.0/P2MAP0) ; port Flow_HTC_ON
NetP501_3: U100.36(P1.2/TA0.1/S37) ; port Flow_HTS_PWM
NetP501_4: U100.20(P2.3/P2MAP3) ; port CO2_Hz_dig
NetP501_5: U100.18(P2.1/P2MAP1) ; port CO2_S1_dig
NetP501_6: U100.19(P2.2/P2MAP2) ; port CO2_S2_dig
NetP501_7: U100.21(P2.4/P2MAP4) ; port PRES_INT1
NetP501_8: U100.22(P2.5/P2MAP5) ; port PRES_INT2
NetR102_2: R102.2 U100.78(PUR)
NetR107_1: R107.1 R109.2 ; port WP_~{WPG}
NetR107_2: R107.2 R108.2 U100.72(P9.4/UCB2CLK/UCA2STE/S3)
NetR305_2: U100.37(P1.3/TA0.2/S36) ; port LADE_MODE
NetR306_2: U100.34(P1.0/TA0CLK/ACLK/S39) ; port USB_STROM_LIMIT
NetR310_1: U100.38(P1.4/TA0.3/S35) ; port Status_Enable
NetR310_2: U100.39(P1.5/TA0.4/S34) ; port Lade_Power_Good
NetR311_2: U100.40(P1.6/TA0.1/S33) ; port Akku_Status2
NetR312_2: U100.41(P1.7/TA0.2/S32) ; port Akku_Status1
NetR316_1: U100.61(P8.3/UCA1RXD/UCA1SOMI/S12) ; port PWR_CNCT_HIGH
NetST600_2: U100.55(P4.5/TB0.5/S18) ; port NFC_INT2
NetST600_3: U100.54(P4.4/TB0.4/S19) ; port NFC_INT1
NetST600_6: U100.62(P8.4/UCB1CLK/UCA1STE/S11) ; port NFC_SW_3V
NetTP100_1: TP100.1 U100.88(P5.7/RTCCLK)
NetTP101_1: TP101.1 U100.50(P4.0/TB0.0/S23)
NetU100_5: U100.5(P7.4/CB8/A12) ; port OLED_RESET#
NetU100_6: U100.6(P7.5/CB9/A13) ; port OLED_D/CMD#
NetU100_7: U100.7(P7.6/CB10/A14/DAC0) ; port OLED_WR#
NetU100_8: U100.8(P7.7/CB11/A15/DAC1) ; port OLED_RD#
NetU100_52: U100.52(P4.2/TB0.2/S21) ; port OLED_Power_Enable
NetU100_53: U100.53(P4.3/TB0.3/S20) ; port OLED_CS#
NetU100_91: U100.91(TEST/SBWTCK) X100.7
NetU100_92: U100.92(PJ.0/TDO) X100.2
NetU100_93: U100.93(PJ.1/TDI/TCLK) X100.3
NetU100_94: U100.94(PJ.2/TMS) X100.4
NetU100_95: U100.95(PJ.3/TCK) X100.5

Not connected (* = marked no-connect by the designer): U100 30(COM0)

### Buses and harness runs
bus OLED_D[7..0] = port OLED_D[7..0]
harness RF = port RF

### Notes on the sheet
- TBCCR3: S2 - phase
- TBCCR2: S1 - phase
- TBCCR4: Heizer-Power
- Flow-Chip-Heizung
- (near U100) P2MAP-Port wegen Flexibilität verwendet
- Macht aus jeder Flanke
  an TBCCR1
  einen kurzen Impuls
  an DMAE0
- Drucksensor-Interrupt 1
- Drucksensor-Interrupt 2
- I²C für Druck und Akku
- Flow: TP1
- (near U102) 4-Kanal-DA-Wandler
- CO2: Heizer Strom
- Flow: TP2
- CO2: S1 - Temperatur
- CO2: S2 - Temperatur
- Flow: TPT (Membran-Temp)
- Flow: Temp-Diode (Chip-Temp)
- (near TP102) TBCCR1: ADC-Sample-Zeitpunkt
- (near U100) Alternative zu Flow_HTS_PWM
- (near Q100) GND von Quarz
- Project Name:
- Size:
- Date:
- Title:
- A4
- Time:
- Revision:
- Sheet
- of
- File:

### Library data of the parts
C100 = Kondensator SMD Keramik: 07_Lieferant: Digi-Key; 08_Lieferanten_Nummer: 399-1091-1-ND
C101 = Kondensator SMD Keramik: 07_Lieferant: Digi-Key; 08_Lieferanten_Nummer: 399-1082-1-ND
C102 C104 C106 C116-C118 C121 = Kondensator SMD Keramik: as C300 on sheet EIS_Main_Akku
C103 C119 C120 = Kondensator SMD Keramik: 07_Lieferant: Digi-Key; 08_Lieferanten_Nummer: 490-7201-1-ND
C105 C107 C108 C111 = Kondensator SMD Keramik
C109 C113 C114 = Kondensator SMD Keramik: 07_Lieferant: Digi-Key; 08_Lieferanten_Nummer: 445-1318-1-ND
C110 = Kondensator SMD Keramik: 07_Lieferant: Digi-Key; 08_Lieferanten_Nummer: 445-5152-1-ND
C112 = Kondensator SMD Keramik: 07_Lieferant: Digi-Key; 08_Lieferanten_Nummer: 1276-1098-1-ND
C115 = Kondensator SMD Keramik: 07_Lieferant: Digi-Key; 08_Lieferanten_Nummer: 1276-2087-1-ND
D100 D101 = LED SMD: 07_Lieferant: Farnell; Supplier 1: Farnell
  D100: 08_Lieferanten_Nummer: 1226427
  D101: 08_Lieferanten_Nummer: 1226397
NT100 = Net Tie without Boom: 09_Ersteller: HSG Jürgen Merz; 02_Herstellerbezeichnung: ka; 10_Erstell_Datum: 28.09.2009
Q100 = QUARZ: 07_Lieferant: Farnell; 08_Lieferanten_Nummer: 1657888
Q101 = XTAL: Uhren Quarz - Crystal; Published: 8-Jun-2000; LatestRevisionDate: 17-Jul-2002; LatestRevisionNote: Re-released for DXP Platform.; PackageReference: R38; Publisher: Altium Limited; PackageDescription: Crystal, Thru-Hole; 2 Leads; Body 3.1 x 8.2 mm (Dia.xH); 07_Lieferant: Farnell; 08_Lieferanten_Nummer: 2101347
R100 = Widerstand SMD: 07_Lieferant: Digi-Key; 08_Lieferanten_Nummer: 311-47KGRCT-ND
R101 R109 = Widerstand SMD: 07_Lieferant: Digi-Key; 08_Lieferanten_Nummer: 311-10KGRCT-ND
R102 = Res2: as R307 on sheet EIS_Main_Akku; Published: 8-Jun-2000; LatestRevisionDate: 17-Jul-2002; LatestRevisionNote: Re-released for DXP Platform.; PackageReference: AXIAL-0.4; Publisher: Altium Limited; Value: 1.5k
R103 R105 = Widerstand SMD: 07_Lieferant: Digi-Key; 08_Lieferanten_Nummer: 311-330GRCT-ND
R104 = Widerstand SMD: 07_Lieferant: Digi-Key; 08_Lieferanten_Nummer: 311-1.00MHRCT-ND
R106 = RESC1608 (R0603): as R400 on sheet EIS_Main_Radio; Supplier 1: Farnell; Supplier Part Number 1: 2008343
R107 R108 = Res2: as R305 on sheet EIS_Main_Akku; Published: 8-Jun-2000; LatestRevisionDate: 17-Jul-2002; LatestRevisionNote: Re-released for DXP Platform.; PackageReference: AXIAL-0.4; Publisher: Altium Limited; Value: 100k
TP100-TP102 = Tespoint 1mm: Published: 17.09.2009; Publisher: HSG Jürgen MErz
U100 = MSP430F6658IPZR: 20 MHz Mixed Signal Microcontroller with 256 KB Flash, 16384 B SRAM and 74 GPIOs, -40 to 85 degC, 100-pin QFP (PZ), Green (RoHS & no Sb/Br); Manufacturer: Texas Instruments; PartNumber: MSP430F6638IPZR; ADC: 12-bit SAR; ADC Channels: 16; Brown Out Reset: Yes; DAC: 2; DMA: 3; Flash(KB): 256; Frequency(MHz): 20; GPIO: 74; Multiplier: 32x32; Real-Time Clock: Yes, with battery backup; SRAM(B): 16384; SubFamily: 6 Series with LCD; Timers - 16-bit: 4; USB: 1; DatasheetVersion: SLAS566C; PackageVersion: 4040149/B; PackageReference: PZ100; PackageDescription: 100-Pin Plastic Flat Pack, Body 14 x 14 mm, Pitch 0.5 mm; Comparators: Yes; Eco-Plan: Green (RoHS & no Sb/Br); SVS: Yes; Temp Sensor: Yes; USCI_A (UART/LIN/IrDA/SPI): 2; USCI_B (I2C & SPI): 2; Watchdog: Yes; Mounting Technology: Surface Mount; Code_JEDEC: MS-026; ComponentLink1Description: Manufacturer URL; ComponentLink1URL: http://www.ti.com/; ComponentLink2Description: Datasheet; ComponentLink2URL: http://www.ti.com/general/docs/lit/getliterature.tsp?genericPartNumber=MSP430F6638&fileType=pdf; ComponentLink3Description: Package Specification; ComponentLink3URL: http://www.ti.com/lit/ml/mtqf013a/mtqf013a.pdf; 07_Lieferant: Mouser; 08_Lieferanten_Nummer: 595-MSP430F6658IPZ
U101 = MC74VHC1G86DFT1: 2-Input XOR Gate; Published: 15-Apr-2002; LatestRevisionDate: 12-Dec-2006; LatestRevisionNote: IPC-7351 Footprint Added.; DatasheetVersion: Dec-1999; PackageVersion: Oct-1999; PackageReference: 419A-01; Publisher: Altium Limited; PackageDescription: 5-Pin SOT-353 Package 0.65 mm Pitch, 2.1 mm Lead Span; ComponentLink1Description: Manufacturer Link; ComponentLink1URL: http://www.onsemi.com/; ComponentLink2Description: Datasheet; ComponentLink2URL: http://www.onsemi.com/pub/Collateral/MC74VHC1G86-D.PDF; 07_Lieferant: Farnell; 08_Lieferanten_Nummer: 1287455
U102 = DAC 124S085CIMM: DAC 4 Channel 12-Bit; 07_Lieferant: Digi-Key; 08_Lieferanten_Nummer: DAC124S085CIMM/NOPBCT-ND
X100 = JMP 8*1.27